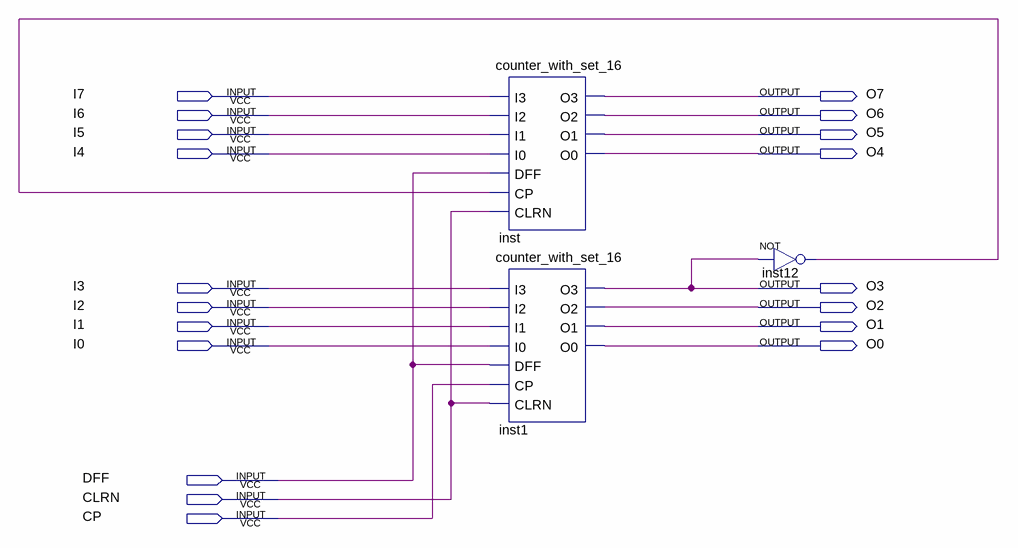
[diagram p0: schematic sheet]
// Quartus schematic counter_with_set_256.bdf as structural Verilog: 3 symbols, 19 pins
module counter_with_set_256 (
  input  I7,
  input  I6,
  input  I5,
  input  I4,
  input  I3,
  input  I2,
  input  I1,
  input  I0,
  input  DFF,
  input  CLRN,
  input  CP,
  output O7,
  output O6,
  output O5,
  output O4,
  output O3,
  output O2,
  output O1,
  output O0
);

  wire inst12_out;

  counter_with_set_16 inst (
    .I3(I7), .I2(I6), .I1(I5), .I0(I4), .DFF(DFF), .CP(inst12_out), .CLRN(CLRN), .O3(O7), .O2(O6), .O1(O5),
    .O0(O4));
  counter_with_set_16 inst1 (
    .I3(I3), .I2(I2), .I1(I1), .I0(I0), .DFF(DFF), .CP(CP), .CLRN(CLRN), .O3(O3), .O2(O2), .O1(O1), .O0(O0));
  not inst12 (inst12_out, O3);
endmodule
